# EAGLE design LCMeter_test_power_inverter_VER2 (EAGLE 6.1)
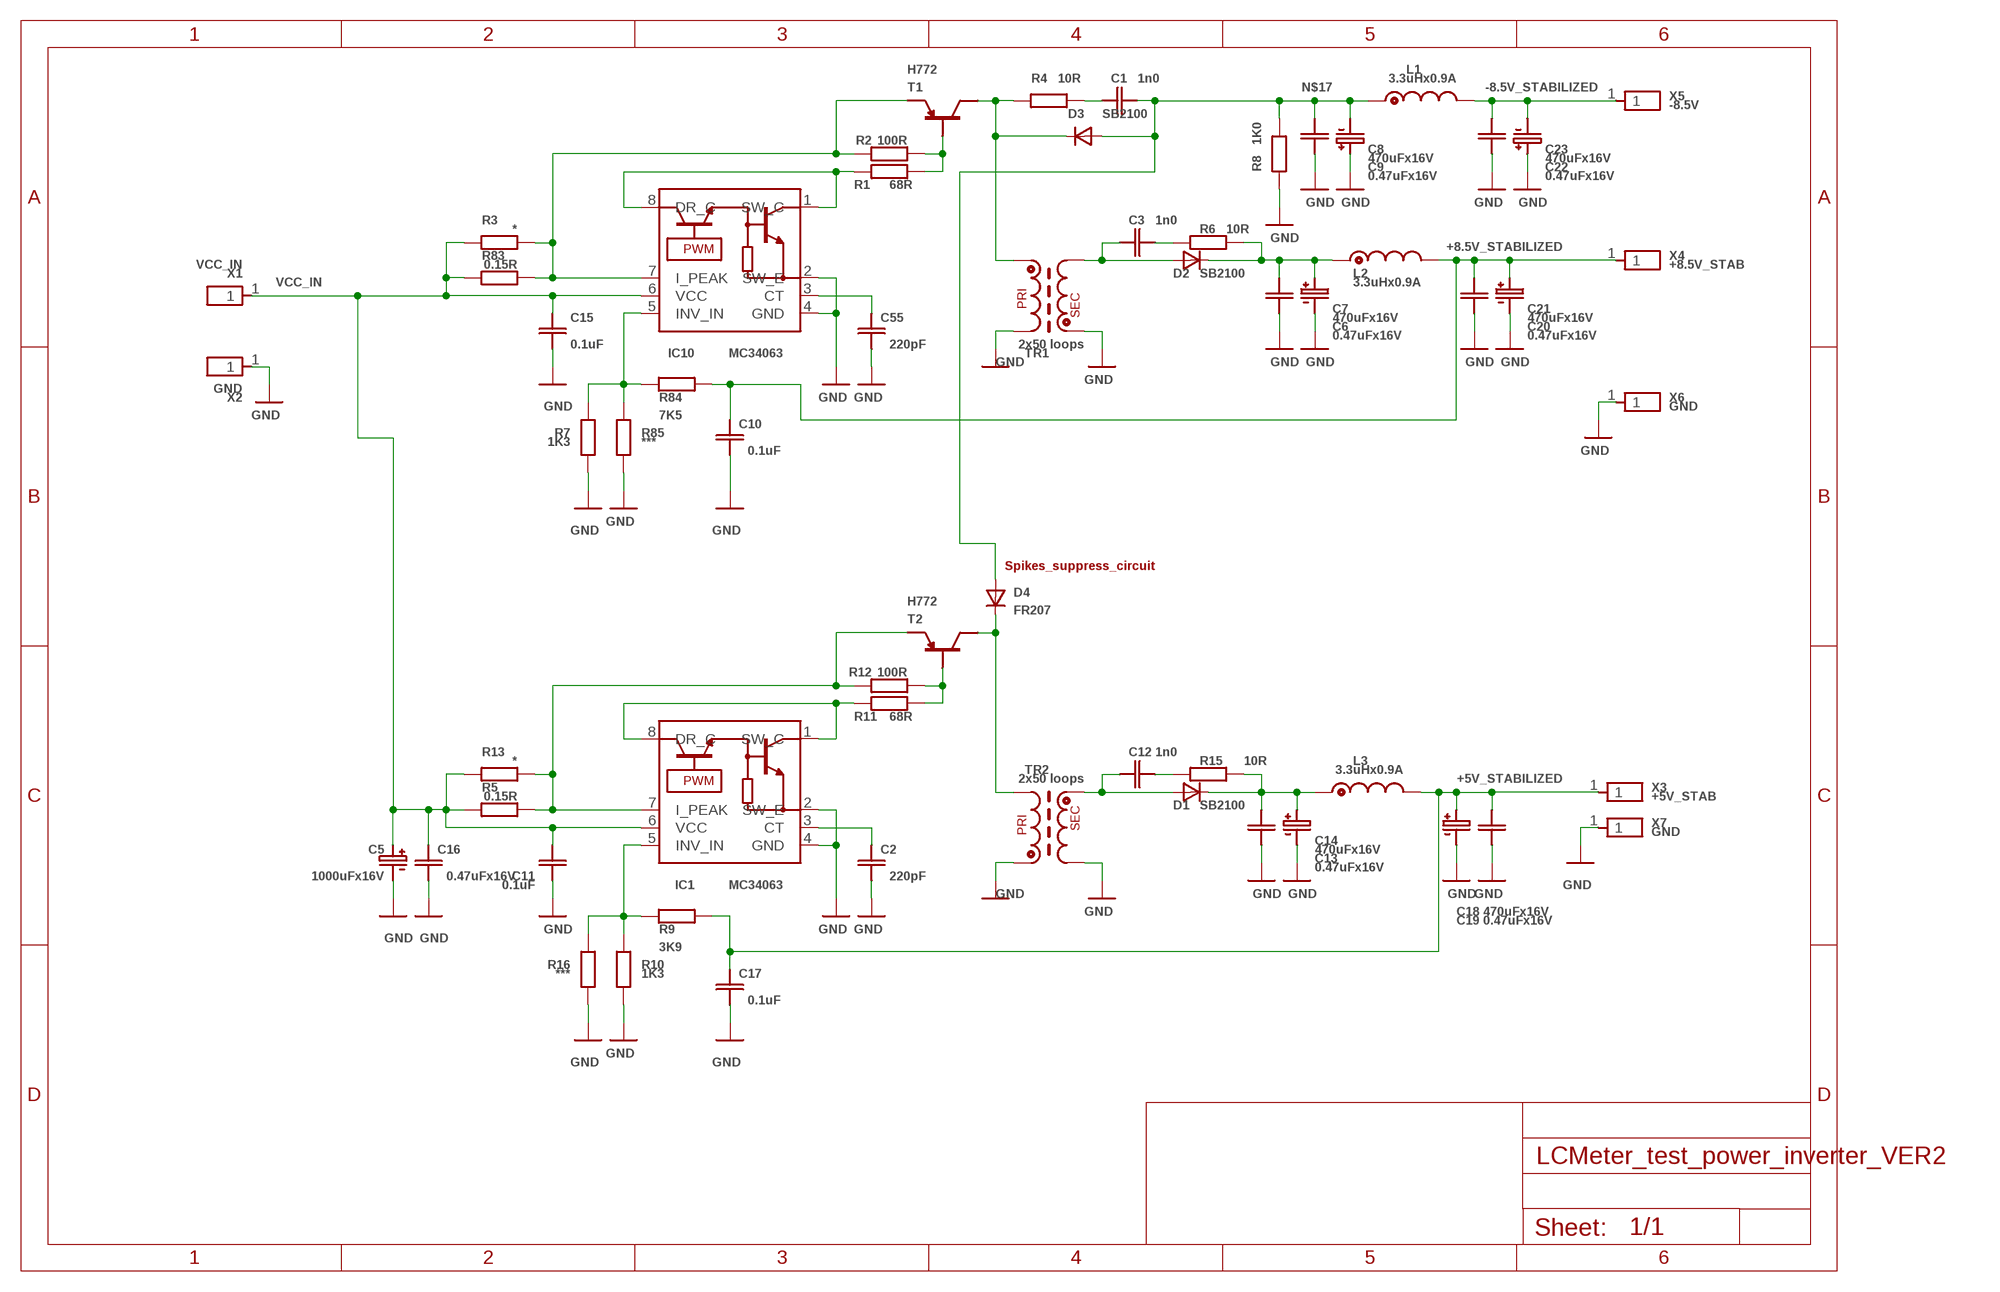
[diagram p0: schematic, sheet 1]

## Parts
C1  1n0  CSMD_0805  [RSMD_0805]
C2  220pF  CSMD_0805  [RSMD_0805]
C3  1n0  CSMD_0805  [RSMD_0805]
C5  1000uFx16V  CE10MM  [CE_10MM]
C6  0.47uFx16V  CSMD_1206_BIG_GAP  [RSMD_1206_BIG_GAP]
C7  470uFx16V  CE10MM  [CE_10MM]
C8  470uFx16V  CE10MM  [CE_10MM]
C9  0.47uFx16V  CSMD_1206_BIG_GAP  [RSMD_1206_BIG_GAP]
C10  0.1uF  CSMD_0805  [RSMD_0805]
C11  0.1uF  CSMD_0805  [RSMD_0805]
C12  1n0  CSMD_0805  [RSMD_0805]
C13  0.47uFx16V  CSMD_1206_BIG_GAP  [RSMD_1206_BIG_GAP]
C14  470uFx16V  CE10MM  [CE_10MM]
C15  0.1uF  CSMD_0805  [RSMD_0805]
C16  0.47uFx16V  CSMD_1206  [RSMD_1206]
C17  0.1uF  CSMD_0805  [RSMD_0805]
C18  470uFx16V  CE10MM  [CE_10MM]
C19  0.47uFx16V  CSMD_1206_BIG_GAP  [RSMD_1206_BIG_GAP]
C20  0.47uFx16V  CSMD_1206_BIG_GAP  [RSMD_1206_BIG_GAP]
C21  470uFx16V  CE10MM  [CE_10MM]
C22  0.47uFx16V  CSMD_1206_BIG_GAP  [RSMD_1206_BIG_GAP]
C23  470uFx16V  CE10MM  [CE_10MM]
C55  220pF  CSMD_0805  [RSMD_0805]
D1  SB2100  1N4001DO-41_5MM  [DO-41_5MM]
D2  SB2100  1N4001DO-41_5MM  [DO-41_5MM]
D3  SB2100  1N4001DO-41_5MM  [DO-41_5MM]
D4  FR207  1N4001DO-41_20MM  [DO-41_20MM]
IC1  MC34063  MC34063(DIP8)  [DIP8]
IC10  MC34063  MC34063(DIP8)  [DIP8]
L1  3.3uHx0.9A  L(SENIA)  [L_SENIA]
L2  3.3uHx0.9A  L(SENIA)  [L_SENIA]
L3  3.3uHx0.9A  L(SENIA)  [L_SENIA]
R1  68R  RSMD_0805  [RSMD_0805]
R2  100R  RSMD_0805  [RSMD_0805]
R3  *  RSMD_1206_BIG_GAP  [RSMD_1206_BIG_GAP]
R4  10R  RSMD_0805  [RSMD_0805]
R5  0.15R  RSMD_1206_BIG_GAP  [RSMD_1206_BIG_GAP]
R6  10R  RSMD_0805  [RSMD_0805]
R7  1K3  RSMD_0805  [RSMD_0805]
R8  1K0  RSMD_1206_BIG_GAP  [RSMD_1206_BIG_GAP]
R9  3K9  RSMD_0805  [RSMD_0805]
R10  1K3  RSMD_0805  [RSMD_0805]
R11  68R  RSMD_0805  [RSMD_0805]
R12  100R  RSMD_0805  [RSMD_0805]
R13  *  RSMD_1206_BIG_GAP  [RSMD_1206_BIG_GAP]
R15  10R  RSMD_0805  [RSMD_0805]
R16  ***  RSMD_0805  [RSMD_0805]
R83  0.15R  RSMD_1206_BIG_GAP  [RSMD_1206_BIG_GAP]
R84  7K5  RSMD_0805  [RSMD_0805]
R85  ***  RSMD_0805  [RSMD_0805]
T1  H772  H772_PNPDPAK  [DPAK]
T2  H772  H772_PNPDPAK  [DPAK]
TR1  2x50 loops  TRANS_2WIND(RING_16X8)  [RING_16X8_2WIND]
TR2  2x50 loops  TRANS_2WIND(RING_16X8)  [RING_16X8_2WIND]
X1  VCC_IN  PIN1X13.5MM_PWR  [PIN1X1_3.5MM_PWR]
X2  GND  PIN1X13.5MM_PWR  [PIN1X1_3.5MM_PWR]
X3  +5V_STAB  PIN1X13.5MM_PWR  [PIN1X1_3.5MM_PWR]
X4  +8.5V_STAB  PIN1X13.5MM_PWR  [PIN1X1_3.5MM_PWR]
X5  -8.5V  PIN1X13.5MM_PWR  [PIN1X1_3.5MM_PWR]
X6  GND  PIN1X13.5MM_PWR  [PIN1X1_3.5MM_PWR]
X7  GND  PIN1X13.5MM_PWR  [PIN1X1_3.5MM_PWR]

## Nets
+5V_STABILIZED: C17.PAD_1(PIN1) C18.PLUS C19.PAD_1(PIN1) L3.1(END) R9.PAD_1(PIN1) X3.1
+8.5V_STABILIZED: C10.PAD_1(PIN1) C20.PAD_1(PIN1) C21.PLUS L2.1(END) R84.PAD_1(PIN1) X4.1
-8.5V_STABILIZED: C22.PAD_1(PIN1) C23.MINUS L1.1(END) X5.1
GND: C2.PAD_0(PIN0) C5.MINUS C6.PAD_0(PIN0) C7.MINUS C8.PLUS C9.PAD_0(PIN0) C10.PAD_0(PIN0) C11.PAD_0(PIN0) C13.PAD_0(PIN0) C14.MINUS C15.PAD_0(PIN0) C16.PAD_0(PIN0) C17.PAD_0(PIN0) C18.MINUS C19.PAD_0(PIN0) C20.PAD_0(PIN0) C21.MINUS C22.PAD_0(PIN0) C23.PLUS C55.PAD_0(PIN0) IC1.2(SW_E) IC1.4(GND) IC10.2(SW_E) IC10.4(GND) R7.PAD_0(PIN0) R8.PAD_1(PIN1) R10.PAD_0(PIN0) R16.PAD_0(PIN0) R85.PAD_0(PIN0) TR1.W1_END(PRI_END) TR1.W2_START(SEC_START) TR2.W1_START(PRI_START) TR2.W2_END(SEC_END) X2.1 X6.1 X7.1
N$1: C3.PAD_0(PIN0) R6.PAD_1(PIN1)
N$2: R1.PAD_1(PIN1) R2.PAD_0(PIN0) T1.1(B)
N$3: IC10.7(I_PEAK) R2.PAD_1(PIN1) R3.PAD_1(PIN1) R83.PAD_1(PIN1) T1.3(E)
N$4: D3.CATHODE R4.PAD_1(PIN1) T1.2(C) TR1.W1_START(PRI_START)
N$5: C1.PAD_1(PIN1) R4.PAD_0(PIN0)
N$6: IC1.1(SW_C) IC1.8(DR_C) R11.PAD_0(PIN0)
N$7: C2.PAD_1(PIN1) IC1.3(CT)
N$8: C3.PAD_1(PIN1) D2.ANODE TR1.W2_END(SEC_END)
N$9: IC1.5(INV_IN) R9.PAD_0(PIN0) R10.PAD_1(PIN1) R16.PAD_1(PIN1)
N$10: R11.PAD_1(PIN1) R12.PAD_0(PIN0) T2.1(B)
N$11: IC1.7(I_PEAK) R5.PAD_1(PIN1) R12.PAD_1(PIN1) R13.PAD_1(PIN1) T2.3(E)
N$12: D4.CATHODE T2.2(C) TR2.W1_END(PRI_END)
N$14: C12.PAD_1(PIN1) D1.ANODE TR2.W2_START(SEC_START)
N$15: C12.PAD_0(PIN0) R15.PAD_1(PIN1)
N$17: C1.PAD_0(PIN0) C8.MINUS C9.PAD_1(PIN1) D3.ANODE D4.ANODE L1.2(START) R8.PAD_0(PIN0)
N$18: C13.PAD_1(PIN1) C14.PLUS D1.CATHODE L3.2(START) R15.PAD_0(PIN0)
N$19: C6.PAD_1(PIN1) C7.PLUS D2.CATHODE L2.2(START) R6.PAD_0(PIN0)
N$133: IC10.1(SW_C) IC10.8(DR_C) R1.PAD_0(PIN0)
N$135: C55.PAD_1(PIN1) IC10.3(CT)
N$139: IC10.5(INV_IN) R7.PAD_1(PIN1) R84.PAD_0(PIN0) R85.PAD_1(PIN1)
VCC_IN: C5.PLUS C11.PAD_1(PIN1) C15.PAD_1(PIN1) C16.PAD_1(PIN1) IC1.6(VCC) IC10.6(VCC) R3.PAD_0(PIN0) R5.PAD_0(PIN0) R13.PAD_0(PIN0) R83.PAD_0(PIN0) X1.1

## Notes on the sheet
- Spikes_suppress_circuit

## Library data of the parts
C1-C3 C6 C9-C13 C15-C17 C19 C20 C22 C55 = __MyCommonLib1:C
C5 C7 C8 C14 C18 C21 C23 = __MyCommonLib1:CE
D1-D4 = __MyCommonLib1:1N4001
IC1 IC10 = __MyCommonLib1:MC34063
L1-L3 = __MyCommonLib1:L
R1-R13 R15 R16 R83-R85 = __MyCommonLib1:R
T1 T2 = __MyCommonLib1:H772_PNP
TR1 TR2 = __MyCommonLib1:TRANS_2WIND
X1-X7 = __MyCommonLib1:PIN1X1

## Board
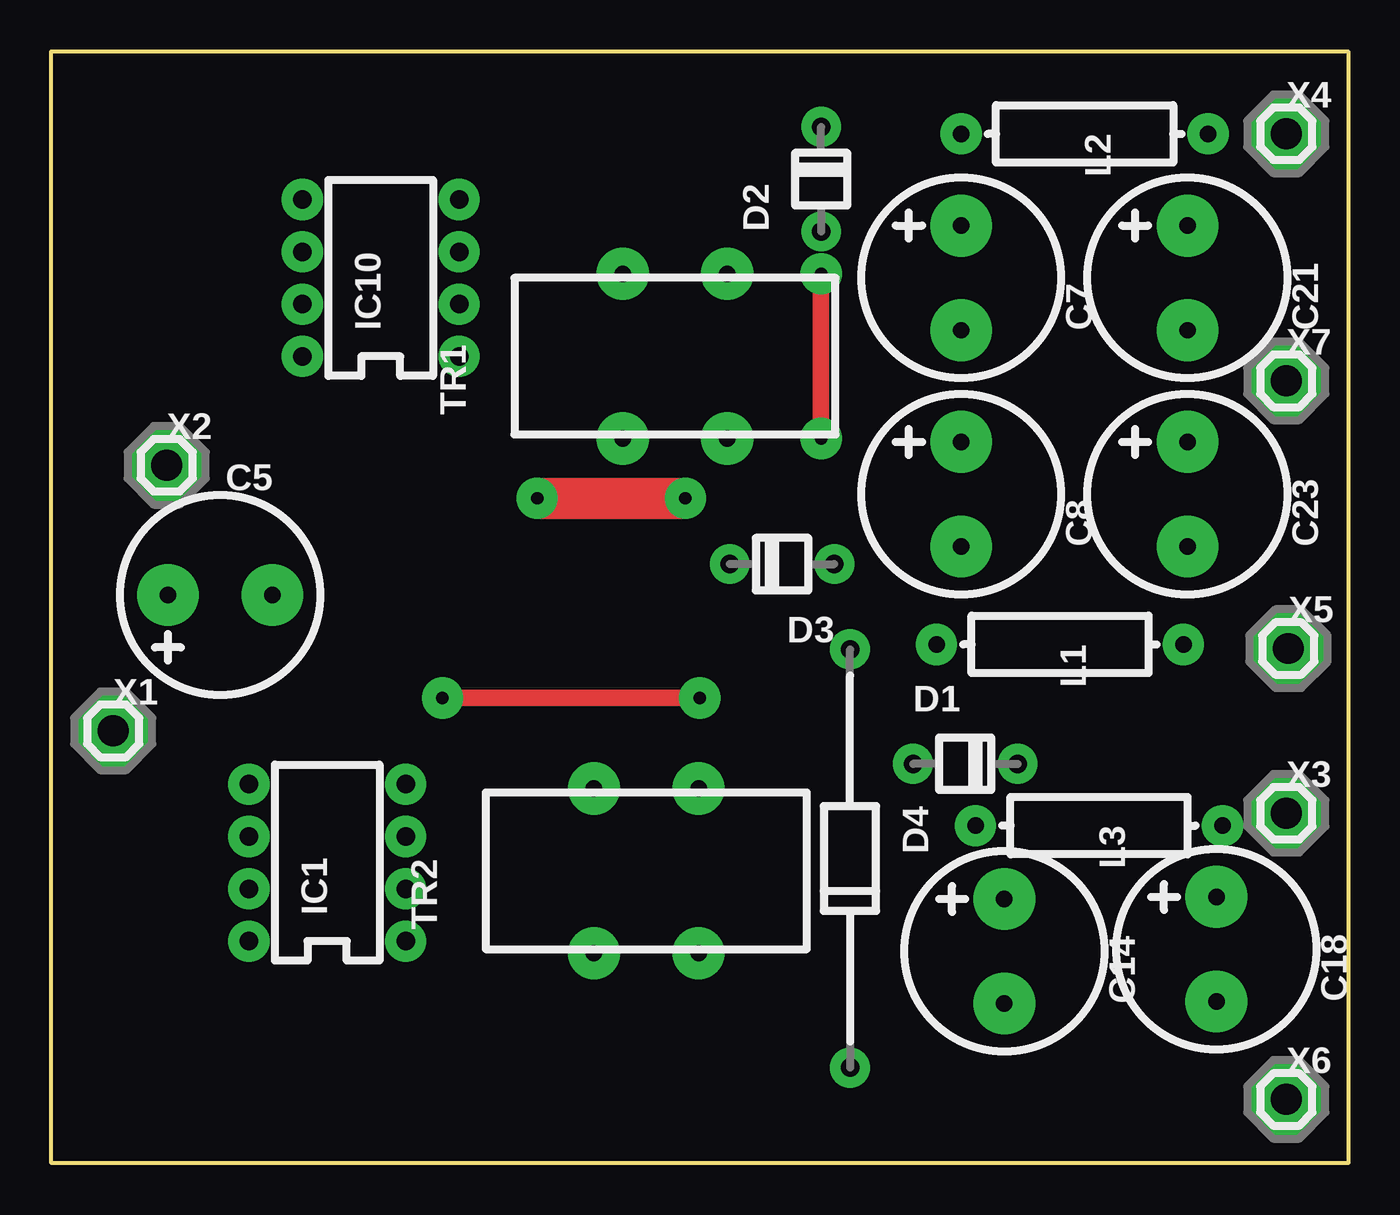
[diagram p1: board, top side]
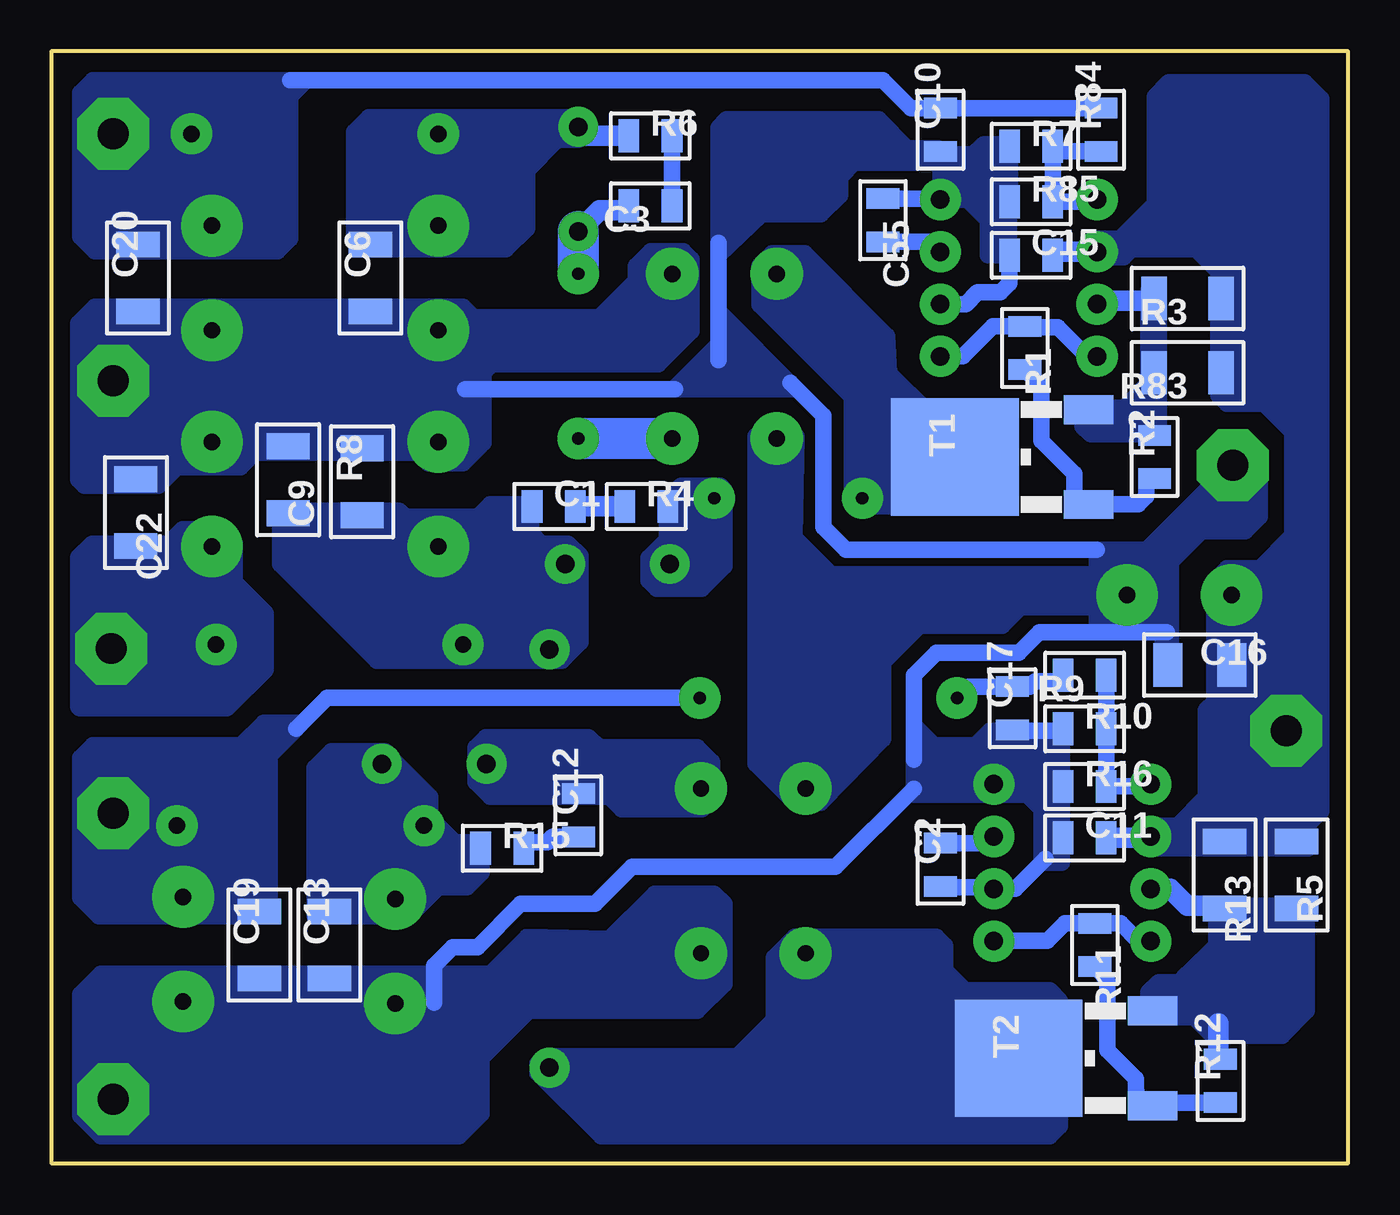
[diagram p2: board, bottom side, seen from below]

Size 63 x 54 mm. Coordinates in mm from the lower left corner, seen from the top.
Outline: 0,0 0,54 63,54 63,0 0,0
Copper layers (1*16): Top 0.035mm / dielectric 1.5mm / Bottom 0.035mm
Design rules: minimum track width 0.35mm, minimum drill 0.6mm, track to track 0.35mm, track to pad 0.35mm, pad to pad 0.35mm, via to via 0.35mm, smd to smd 0.1mm, copper to edge 0.2mm, drill to drill 8mil, minimum pad ring 10mil, minimum via ring 8mil, stop-mask expansion 4mil, vias tented up to drill 0mil, thermal gap 10mil

### Footprints (pad centres in the part's own frame; a part is rotated, then mirrored left to right if it is on the bottom)
RSMD_0805 = smd 1 x 1.6: PAD_0 -1.05,0; PAD_1 1.05,0
CE_10MM = drill 0.8 pad 3: MINUS -2.54,0; PLUS 2.54,0
RSMD_1206_BIG_GAP = smd 1.25 x 2.1: PAD_0 -1.625,0; PAD_1 1.625,0
RSMD_1206 = smd 1.4 x 2.1: PAD_0 -1.55,0; PAD_1 1.55,0
DO-41_5MM = drill 0.9 pad 1.93: ANODE -2.54,0; CATHODE 2.54,0
DO-41_20MM = drill 0.9 pad 1.93: ANODE -10.16,0; CATHODE 10.16,0
DIP8 = drill 0.9 pad 2: 1 -3.81,-3.81; 2 -1.27,-3.81; 3 1.27,-3.81; 4 3.81,-3.81; 5 3.81,3.81; 6 1.27,3.81; 7 -1.27,3.81; 8 -3.81,3.81
L_SENIA = drill 0.8 pad 2: 1 0,6; 2 0,-6
DPAK = smd 1.4 x 2.4: 1 -2.3,-6.5; 3 2.3,-6.5 | smd 5.7 x 6.2: 2 0,0
RING_16X8_2WIND = drill 0.8 pad 2.54: W1_END -4,2.54; W1_START 4,2.54; W2_END -4,-2.54; W2_START 4,-2.54
PIN1X1_3.5MM_PWR = drill 1.5 pad 3.5 octagon: 1 0,0

### Placement (x,y rotation side)
C1  38.6,31.9 0 bottom
C2  19.8,14.5 90 bottom
C3  33.9,46.5 180 bottom
C5  8.2,27.6 180 top
C6  47.5,43 90 bottom
C7  44.2,43 90 top
C8  44.2,32.5 90 top
C9  51.5,33.2 270 bottom
C10  19.8,50.2 90 bottom
C11  12.8,15.8 0 bottom
C12  37.4,16.9 90 bottom
C13  49.5,10.6 90 bottom
C14  46.3,10.3 90 top
C15  15.4,44.1 0 bottom
C16  7.2,24.2 0 bottom
C17  16.3,22.1 90 bottom
C18  56.6,10.4 90 top
C19  52.9,10.6 90 bottom
C20  58.8,43 90 bottom
C21  55.2,43 90 top
C22  58.9,31.6 270 bottom
C23  55.2,32.5 90 top
C55  22.6,45.8 270 bottom
D1  44.4,19.4 0 top
D2  37.4,47.8 90 top
D3  35.5,29.1 180 top
D4  38.8,14.8 270 top
IC1  13.4,14.6 90 top
IC10  16,43 90 top
L1  49,25.2 270 top
L2  50.2,50 270 top
L3  50.9,16.4 270 top
R1  15.7,39.6 270 bottom
R2  9.4,34.3 90 bottom
R3  7.8,42 180 bottom
R4  34.1,31.9 0 bottom
R5  2.5,14 270 bottom
R6  33.9,49.9 0 bottom
R7  15.4,49.4 0 bottom
R8  47.9,33.1 90 bottom
R9  12.8,23.7 180 bottom
R10  12.8,21.1 0 bottom
R11  12.3,10.6 270 bottom
R12  6.2,4 90 bottom
R13  6,14 270 bottom
R15  41.1,15.3 0 bottom
R16  12.8,18.3 0 bottom
R83  7.8,38.4 180 bottom
R84  12,50.2 90 bottom
R85  15.4,46.7 0 bottom
T1  19.1,34.3 90 bottom
T2  16,5.1 90 bottom
TR1  30.3,39.2 90 top
TR2  28.9,14.2 90 top
X1  3,21 0 top
X2  5.6,33.9 0 top
X3  60,17 0 top
X4  60,50 0 top
X5  60.1,25 0 top
X6  60,3.1 0 top
X7  60,38 0 top

### Tracks (layer width: path | path; a pad name or v marks a point on that pad's centre or on a via)
+5V_STABILIZED  (via drill 0.6 pad 2)
  Top 0.8: v19,22.6 v31.5,22.6
  Bottom 0.8: R9.PAD_1 14.15,23.4 15.2,23.4 15.45,23.15 C17.PAD_1 18.45,23.15 v19,22.6 | v31.5,22.6 49.6,22.6 51.1,21.1
  pour Bottom (no thermals): 52.9,12 60.7,12 61.6,12.9 61.6,19.7 61,20.3 53.8,20.3 52.7,21.4 50.8,21.4 52.4,19.8 52.4,16.4 52.4,12
+8.5V_STABILIZED
  Bottom 0.8: R84.PAD_1 C10.PAD_1 21.25,51.25 22.6,52.6 51.4,52.6
  pour Bottom (no thermals): 51.4,51.8 51.4,44.9 52,44.3 60.9,44.3 61.6,45 61.6,52 61,52.6 50.6,52.6
-8.5V_STABILIZED
  pour Bottom (no thermals): 54.8,30.7 54.2,30.1 54.2,28.2 52.7,26.7 52.7,24 54.5,22.2 60.7,22.2 61.6,22.2 61.6,29.4 61,30 57.3,30 56.6,30.7
GND
  Bottom 0.8: 12.2,29.8 24.4,29.8 25.5,30.9 25.5,36.3 27.1,37.9 | 30.6,39 30.6,44.7 | 42.9,37.6 32.7,37.6 | C2.PAD_0 19.15,13.45 19.1,13.4 17.28,13.4 IC1.2 16.17,13.33 14.7,14.8 | IC10.2 18.57,41.73 18,42.3 16.9,42.3 16.45,42.75 C15.PAD_0 | C55.PAD_0 19.85,46.85 IC10.4 | 8.8,25.8 15,25.8 16,24.8 20,24.8 21.1,23.7 21.1,19.6 | 21.1,18.2 24.9,14.4 34.8,14.4 36.6,12.6 40.2,12.6 42.3,10.5 43.5,10.5 44.4,9.6 44.4,7.8 | R10.PAD_0 13.95,21 15.4,21
  pour Bottom (no thermals): 30.8,13.1 30.3,12.6 30.3,8.7 31.6,7.4 39.8,7.4 42.1,5.1 42.1,2.4 43.2,1.3 60.6,1.3 61.6,2.3 61.6,8.2 60.6,9.2 44.7,9.2 42.6,9.2 41.7,9.2 39.9,11 35.9,10.9 33.7,13.1
  pour Bottom (no thermals): 16.5,44.1 17.5,44.1 17.5,45.8 18.5,46.8 19.8,46.8 19.8,48.6 20.2,49 18.2,49 17.7,49.5 16.4,49.5
  pour Bottom (no thermals): 19.9,48.4 20.1,48.6 24,48.6 24.7,47.9 24.7,47 25.6,46.1 28.5,46.1 30.6,44.1 30.6,50.3 30.2,50.7 22.8,50.7 21.4,49.3 19.9,49.3
  pour Bottom (no thermals): 43,41.6 60.9,41.6 61.7,40.8 61.7,33.2 61.4,32.9 57.8,32.9 56.9,33.8 53.8,33.8 53.1,34.5 45.2,34.5 44.7,34 43,34 42,35 42,38.4 41.6,38.8 33.5,38.8 31.9,40.4 31.9,43.9 32.3,44.3 33.9,44.3 34.6,43.6 34.6,42.9 36.4,41.1 42.5,41.1
  pour Bottom (no thermals): 32.8,37.6 26.8,37.6 30.6,41.4 30.6,39.8
  pour Bottom (no thermals): 27.2,35.7 26.8,35.3 26.9,30.4 25.1,28.6 12.2,28.6 12.2,29.8 9.8,29.8 6.6,33 6.6,34.7 5.2,34.7 4.3,33.8 4.3,31.4 5,30.7 7.1,30.7 8.6,29.2 8.6,23.9 9,23.9 9,25.6 9.6,26.2 12.2,26.2 12.2,27 15.9,27 16.8,26.1 20.8,26.1 22.6,24.3 22.6,20.6 25.6,17.5 26.9,17.5 28.8,19.4 28.8,35.3 28.4,35.7
  pour Bottom (no thermals): 13.9,21.3 14.2,21 17.4,21 18.1,20.3 20.1,20.3 21.1,21.3 21.1,17.9 15.6,17.9 14.9,17.2 14.9,14.6 13.9,14.6
N$1
  Bottom 0.8: C3.PAD_0 R6.PAD_1
N$2
  Bottom 0.8: R2.PAD_0 arc-90 9.8,32.85 9.8,32.4 10.2,32 T1.1 arc59 13.3,32.4 13.3,33.5 14.9,35.1 14.9,37.75 R1.PAD_1
N$3
  Bottom 1: IC10.7 12.02,41.9 9.5,41.9
  pour Bottom (no thermals): 9.2,35.4 12.5,35.4 12.9,35.8 12.9,36.7 10.9,36.7 9.7,37.9 9.7,42.4 9.2,42.4
N$4  (via drill 0.6 pad 2)
  Top 2: v23.6,32.3 v30.8,32.3
  pour Bottom (no thermals): 16.9,31.9 23.6,31.9 24.1,32.4 24.1,37.2 28.6,41.7 28.6,43.6 28,44.2 26.4,44.2 22.4,40.2 22.3,38.4 20.4,36.5 16.9,36.5
  pour Bottom (no thermals): 30.3,32.7 30.3,29 31.4,27.9 33.6,27.9 34,28.3 34,29.4 33.2,30.2 33.1,30.3 33.1,32.2 32.4,32.9 30.5,32.9
N$5
  Bottom 1: R4.PAD_0 C1.PAD_1
N$6
  Bottom 0.8: IC1.8 10.19,10.79 11.05,11.65 R11.PAD_0 13.75,11.65 14.6,10.8 IC1.1
N$7
  Bottom 0.8: IC1.3 17.53,15.55 C2.PAD_1
N$8  (via drill 0.6 pad 2)
  Top 0.8: v37.4,35.2 v37.4,43.2
  Bottom 1: C3.PAD_1 35.15,46.3 36.36,46.3 D2.ANODE
  Bottom 2: v37.4,43.2 D2.ANODE | TR1.W2_END v37.4,35.2
N$9
  Bottom 0.8: IC1.5 9.7,18.3 R16.PAD_1 R10.PAD_1 R9.PAD_0
N$10
  Bottom 0.8: R11.PAD_1 11.9,9.15 11.9,9.1 11.7,8.9 11.7,5.5 10.3,4.1 10.3,3.6 arc-90 T2.1 9.35,2.95 R12.PAD_0
N$11
  Bottom 1: R12.PAD_1 6.3,5.15 6.3,6.8 | IC1.7 8.63,13.33 7.8,12.5 6.1,12.5
  pour Bottom (no thermals): 2.3,12.5 6.3,12.5 6.4,12.4 6.4,10.6 7.8,9.2 8.2,8.8 9.2,8.8 9.7,8.3 9.7,7.5 9.7,7.1 7.5,7.1 6.6,6.2 6,6.2 3.2,6.2 2,7.4 2,12.2
N$12
  pour Bottom (no thermals): 14,7.9 14,1.8 14.5,1.3 36.3,1.3 39.4,4.4 39.4,4.8 39,5.2 29.7,5.2 27.9,7 27.9,10 26.9,11 20,11 19.6,10.6 19.6,9.4 18.6,8.4 14.5,8.4
N$14
  pour Bottom (no thermals): 31.4,17.2 35.3,17.2 35.9,17.8 41.7,17.8 42.4,18.5 42.4,20.2 41.9,20.7 36.9,20.7 36.4,20.2 31.6,20.2 30.9,19.5 30.9,17.7
N$15
  Bottom 0.8: R15.PAD_1 39.75,15.6 38.9,15.6 38.65,15.85 C12.PAD_0
N$17
  pour Bottom (no thermals): 37.3,29.5 37.3,25.3 38.2,24.4 47.2,24.4 51.9,29.1 51.9,31.7 46.1,31.7 45.8,31.4 42.3,31.4 41.7,32 39.7,32 39.7,30.6 39.2,30.1 37.9,30.1
N$18
  pour Bottom (no thermals): 42.1,15.6 42.1,14.1 42.8,13.4 44.2,13.4 45.6,12 50.2,12 50.2,19.2 49.4,20 46.8,20 46.4,19.6 44.6,17.8 44.6,16.8 43.4,15.6
N$19
  Bottom 1: R6.PAD_0 37,49.9 37.4,50.3
  pour Bottom (no thermals): 37.4,49.7 38.4,49.7 39.9,48.2 39.9,45.4 40.9,44.4 48,44.4 48.3,44.7 48.3,50.1 47.6,50.8 37.4,50.8
N$133
  Bottom 0.8: IC10.8 12.69,39.19 14.1,40.6 15.65,40.6 R1.PAD_0 17.25,40.65 18.71,39.19 IC10.1
N$135
  Bottom 0.8: IC10.3 20.29,44.75 C55.PAD_1
N$139
  Bottom 0.8: R84.PAD_0 14.1,49.15 R7.PAD_1 R85.PAD_1 12.3,46.7 IC10.5
VCC_IN
  Bottom 1: C15.PAD_1 14.18,44.27 IC10.6 | C11.PAD_1 9.66,15.8 IC1.6
  pour Bottom (no thermals): 9.7,15.3 1.9,15.3 1.9,16.5 1.3,17.1 1.3,51.7 2.1,52.5 8.7,52.5 9.4,51.8 9.4,46.6 11.1,44.9 12.4,44.9 12.4,44 10.9,44 10.5,44.4 7.4,44.4 6.3,43.3 6.3,37.3 5.9,36.9 4.1,36.9 2.7,35.5 2.7,30.5 4.3,28.9 5.9,28.9 6.5,28.3 6.5,22.4 6.9,22 6.9,17.8 8.3,16.4 9.7,16.4